# EasyEDA Pro project AddonDragon.epro

# Schematic Schematic1
Board Name: Board1; Create Date: 2025-07-26; Page Name: P1; Project Name: Luxcamp Badge 2025 Body; Schematic Name: Schematic1; Update Date: 2025-07-26; Company: EasyEDA.com; Page Size: A4; Version: V1.0
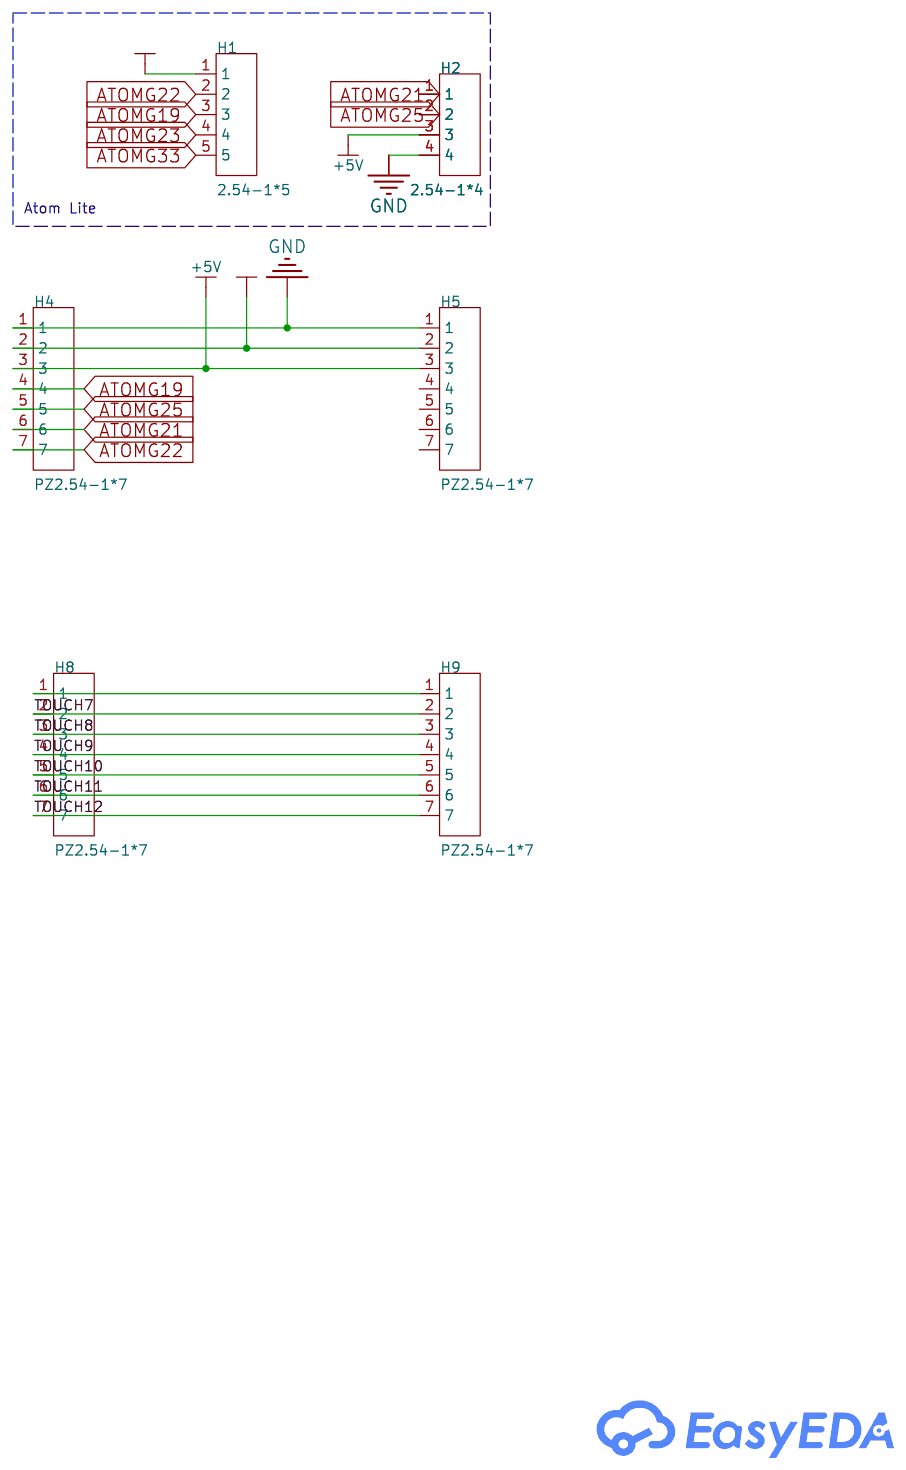
[diagram p0: schematic sheet]

## Parts
H1  2.54-1*5  [HDR-TH_5P-P2.54-V-M]
H2  2.54-1*4  [HDR-TH_4P-P2.54-V-M-1]
H4  PZ2.54-1*7  [HDR-TH_7P-P2.54-V-M]
H5  PZ2.54-1*7  [HDR-TH_7P-P2.54-V-M]
H8  PZ2.54-1*7  [HDR-TH_7P-P2.54-V-M]
H9  PZ2.54-1*7  [HDR-TH_7P-P2.54-V-M]

## Library data of the parts
H1 = 2.54-1*5: Pin Structure:1x5P Pitch:2.54mm Number of Rows:Single Row Number of Pins:5P; Supplier Part: C5156614; Manufacturer: ZHOURI(洲日); Supplier Footprint: 插件,P=2.54mm; JLCPCB Part Class: Extended Part; Datasheet: https://atta.szlcsc.com/upload/public/pdf/source/20250227/F941FC765EF241ABFB2D5D72948A31A5.pdf; Supplier: LCSC; Pin Structure: 1x5P; Pitch: 2.54mm; Number of Rows: Single Row; Number of Pins: 5P
H2 = 2.54-1*4: Pin Structure:1x4P Pitch:2.54mm Number of Rows:Single Row Number of Pins:4P; Supplier Part: C5116483; Manufacturer: ZHOURI(洲日); Supplier Footprint: 插件,P=2.54mm; JLCPCB Part Class: Extended Part; Datasheet: https://atta.szlcsc.com/upload/public/pdf/source/20250227/F941FC765EF241ABFB2D5D72948A31A5.pdf; Supplier: LCSC; Pin Structure: 1x4P; Pitch: 2.54mm; Number of Rows: Single Row; Number of Pins: 4P
H4 H5 H8 H9 = PZ2.54-1*7: Supplier Part: C5360900; Manufacturer: ZHOURI(洲日); Supplier Footprint: 插件,P=2.54mm; JLCPCB Part Class: Extended Part; Datasheet: https://atta.szlcsc.com/upload/public/pdf/source/20250227/F941FC765EF241ABFB2D5D72948A31A5.pdf; Supplier: LCSC

## Nets
3V3: H1.1 H4.2 H5.2
+5V: H2.3 H4.3 H5.3
GND: H2.4 H4.1 H5.1
ATOMG19: H1.3 H4.4
ATOMG21: H2.1 H4.6
ATOMG22: H1.2 H4.7
ATOMG23: H1.4
ATOMG25: H2.2 H4.5
ATOMG33: H1.5
TOUCH7: H8.2 H9.2
TOUCH8: H8.3 H9.3
TOUCH9: H8.4 H9.4
TOUCH10: H8.5 H9.5
TOUCH11: H8.6 H9.6
TOUCH12: H8.7 H9.7
LED_LEFT_OUT: H8.1 H9.1

Not connected (* = marked no-connect by the designer): H5 4 5 6 7

## Notes on the sheet
- Atom Lite

# Board PCB1
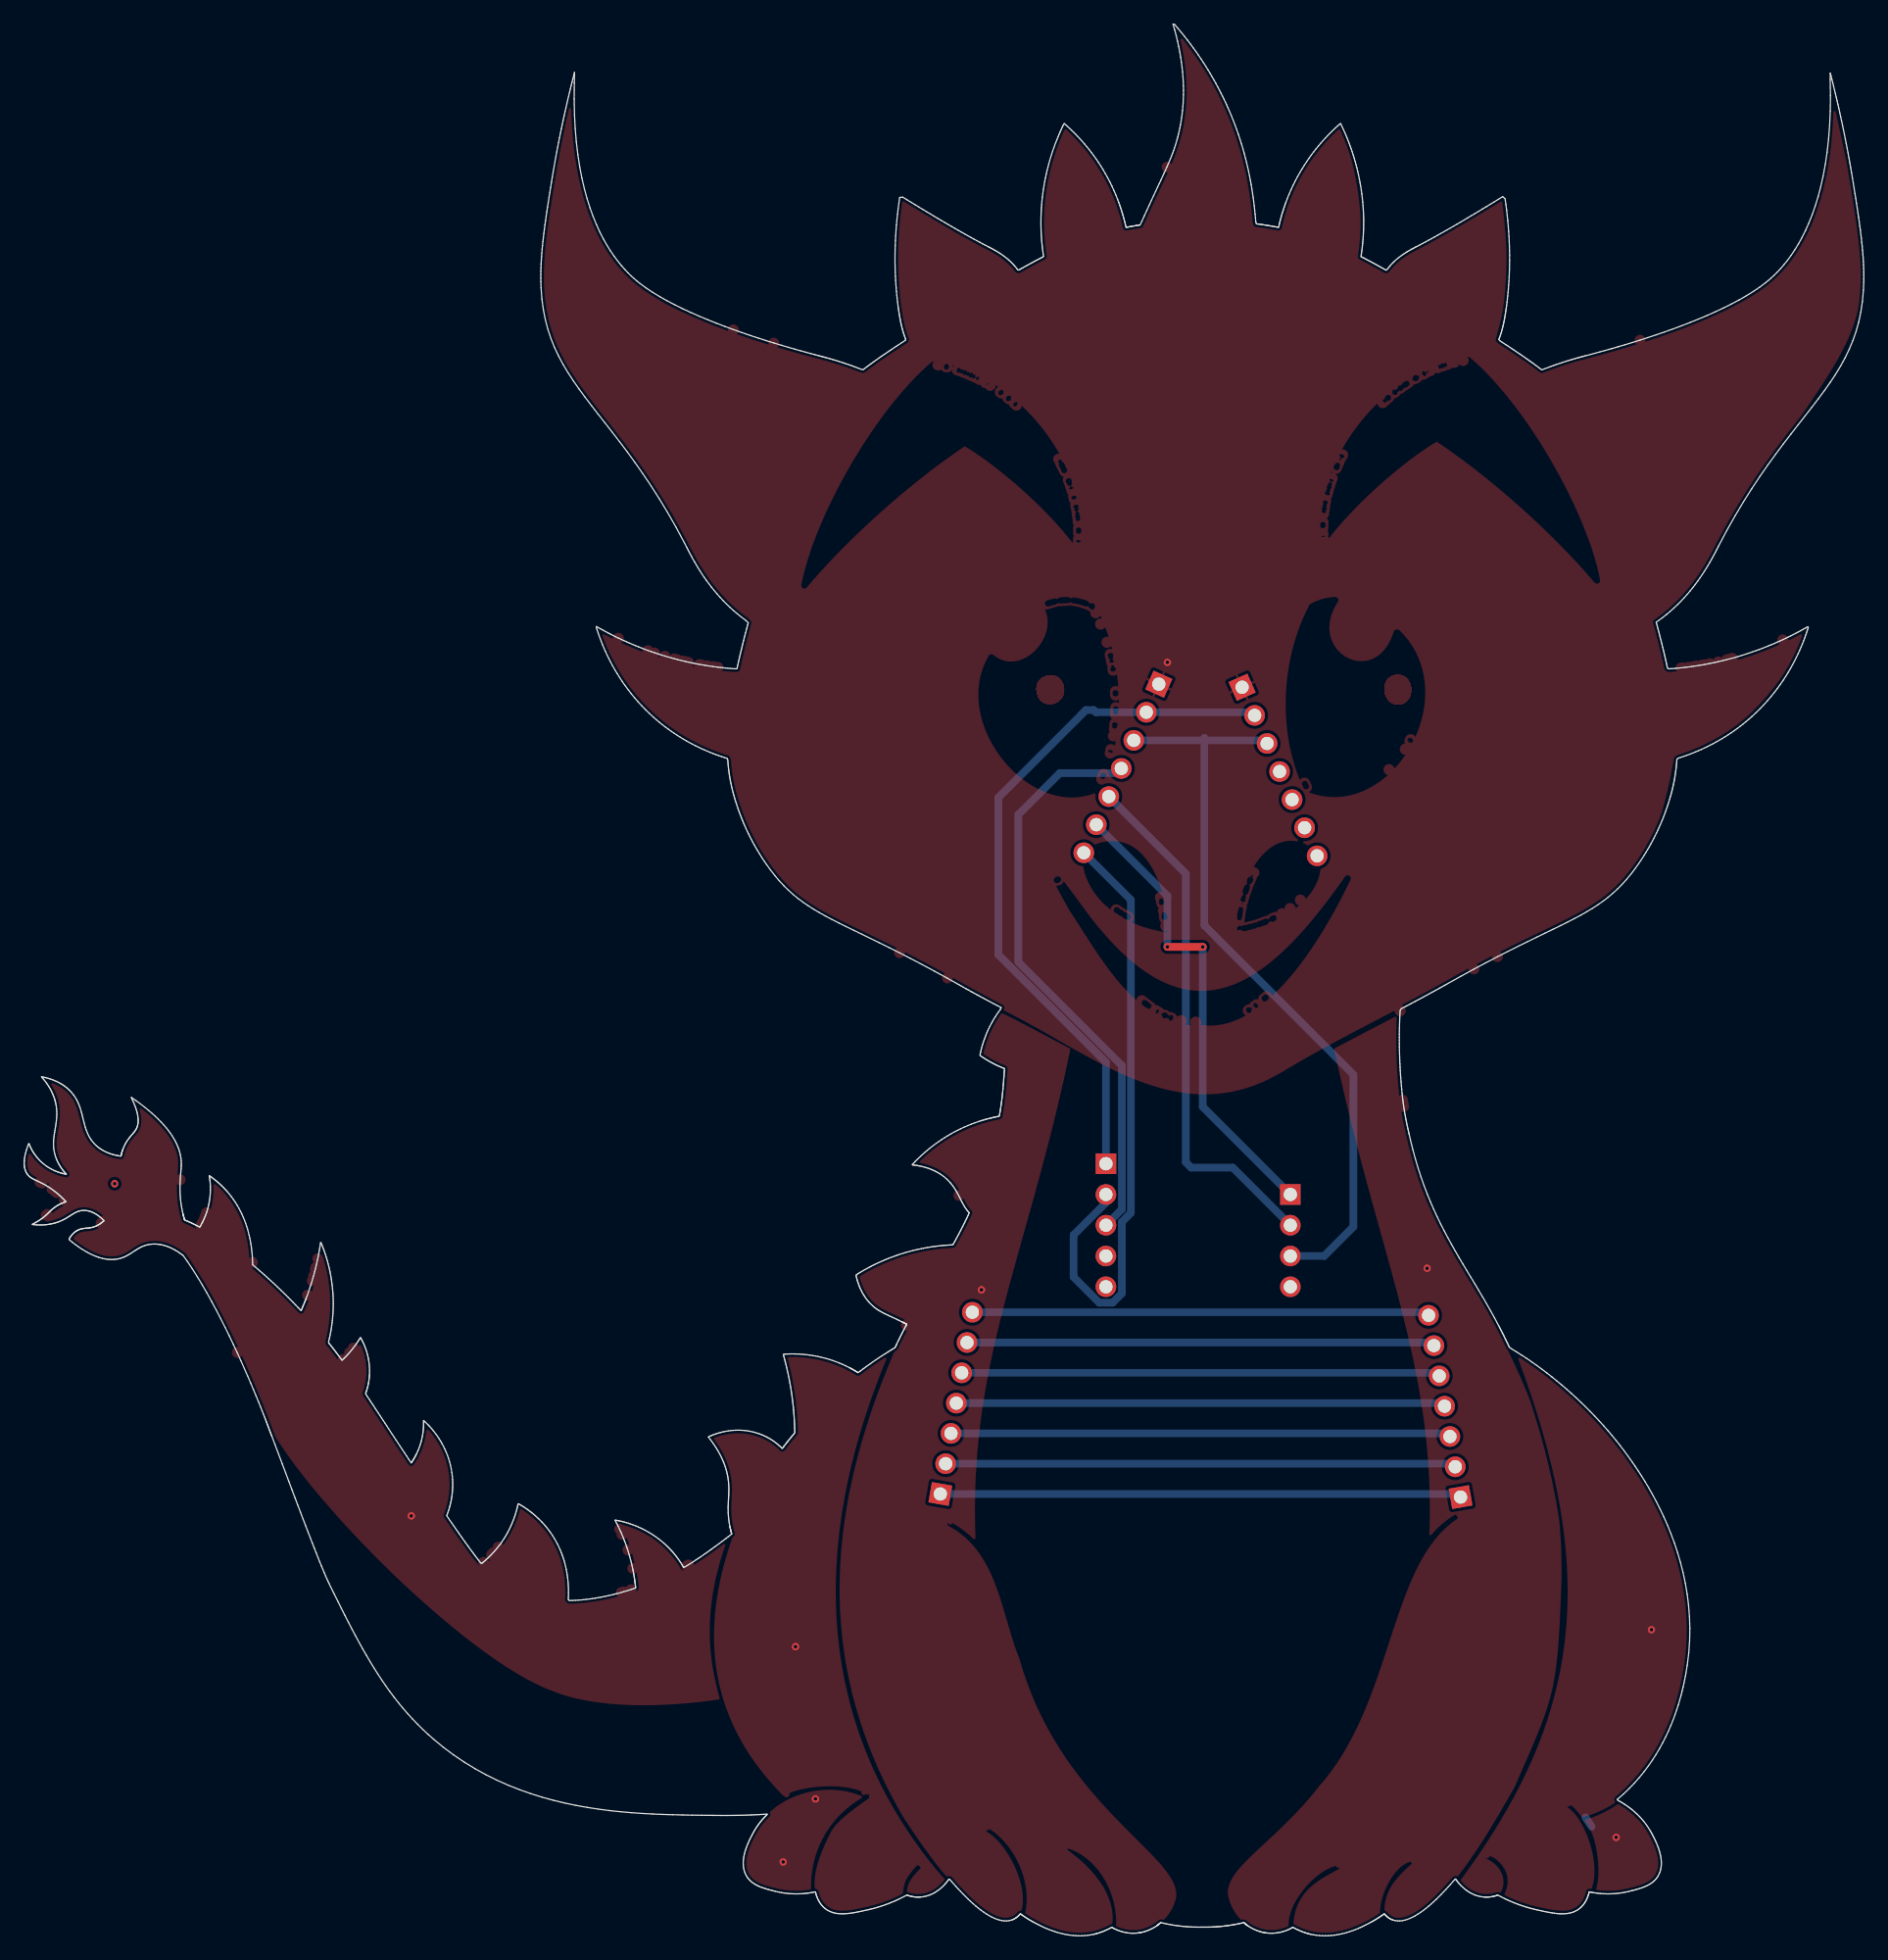
[diagram p1: board, top side]
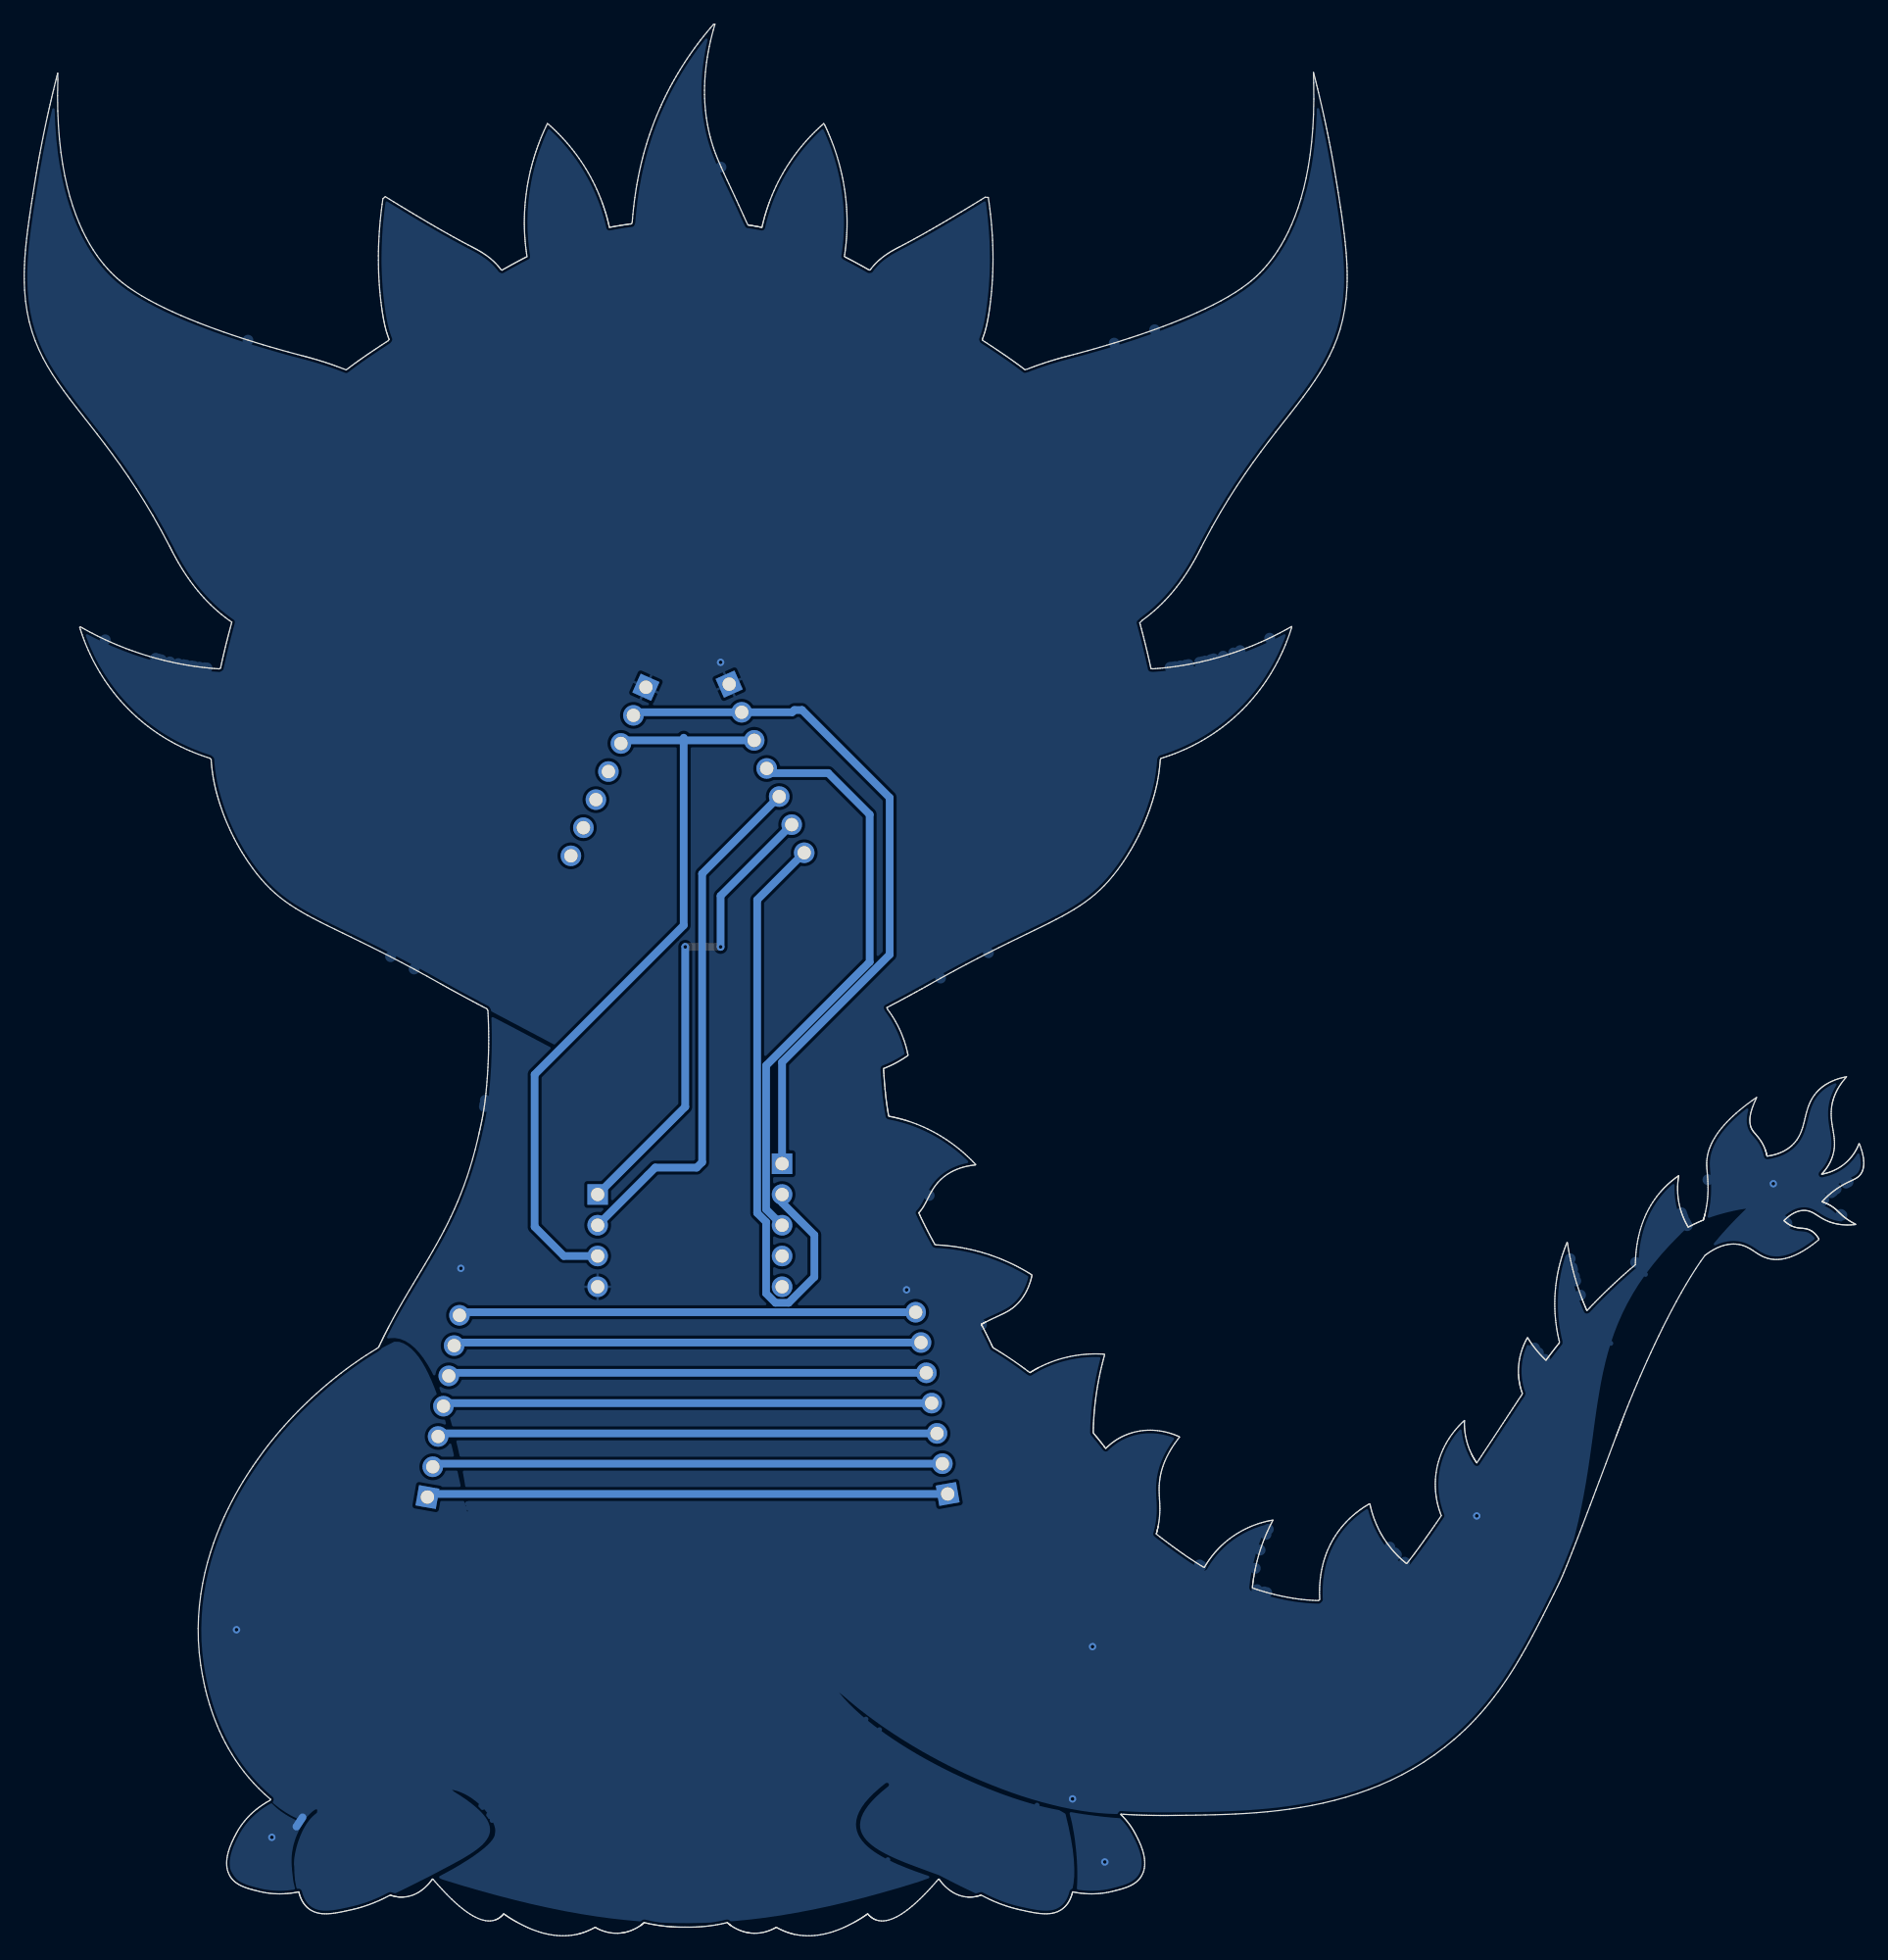
[diagram p2: board, bottom side, seen from below]

Outline 152.02 x 157.85 mm; copper layers: Top Layer, Bottom Layer. Coordinates in mm from the lower left corner of the outline.
Stack: Top Layer 0.035mm / Dielectric1 1.51mm FR4 er 4.5 / Bottom Layer 0.035mm

## Design rules (mm)
template: JLCPCB Capability(Two Layers Board)
spacing copperThickness1oz (default): track to track 0.102, other pairs 0.152 to 0.3
spacing copperThickness2oz: track to track 0.203, other pairs 0.152 to 0.3
track width copperThickness1oz (default): min 0.127, default 0.254, max 2.54
track width copperThickness2oz: min 0.203, default 0.254, max 2.54
differential pair differentialPair (default): width min 0.127, default 0.254, max 2.54; gap min 0.152, default 0.152
via viaSize (default): diameter min 0.5, default 0.61, max 10; hole min 0.3, default 0.305, max 6.3

## Placement (name value [footprint] x y rotation side)
H1  2.54-1*5  [HDR-TH_5P-P2.54-V-M]  89.39 58.67 270 top
H2  2.54-1*4  [HDR-TH_4P-P2.54-V-M-1]  104.63 57.4 270 top
H4  PZ2.54-1*7  [HDR-TH_7P-P2.54-V-M]  90.66 96.39 246 top
H5  PZ2.54-1*7  [HDR-TH_7P-P2.54-V-M]  103.74 96.14 294 top
H8  PZ2.54-1*7  [HDR-TH_7P-P2.54-V-M]  77.03 43.99 80 top
H9  PZ2.54-1*7  [HDR-TH_7P-P2.54-V-M]  117.37 43.73 100 top

## Footprints (pads in the part's own frame, mm; a bottom-side part is the same pattern mirrored in y, then rotated)
HDR-TH_4P-P2.54-V-M-1
  rect 1.7x1.7 hole 1.1: 1(-3.81,0)
  round 1.7 hole 1.1: 2(-1.27,0) 3(1.27,0) 4(3.81,0)
HDR-TH_5P-P2.54-V-M
  rect 1.7x1.7 hole 1.1: 1(-5.08,0)
  round 1.7 hole 1.1: 2(-2.54,0) 3(0,0) 4(2.54,0) 5(5.08,0)
HDR-TH_7P-P2.54-V-M
  rect 1.7x1.7 hole 1.1: 1(-7.62,0)
  round 1.7 hole 1.1: 2(-5.08,0) 3(-2.54,0) 4(0,0) 5(2.54,0) 6(5.08,0) 7(7.62,0)

## Nets
As in the schematic.

## Via types
v1: diameter 0.61, hole 0.305, Top Layer to Bottom Layer, 12 vias

## Routing (per net, layer and track width the routed paths; a pad name or vN(x,y) marks a point on that pad's centre or on a via; arc(x,y) is an arc through that point)
3V3: length 58.3
  Bottom Layer w0.635: H1.1 89.39,72.14 80.5,81.03 80.5,93.98 87.74,101.22 88.37,101.22 88.56,101.03 H4.2 101.42,101.03 H5.2
+5V: length 62.8
  Bottom Layer w0.635: 97.52,98.71 97.52,83.44 109.84,71.12 109.84,58.55 107.42,56.13 H2.3 ; 97.52,98.71 H4.3 ; 97.52,98.71 102.45,98.71 H5.3 ; 97.52,98.71 97.52,98.93
GND: length 0.9
  Bottom Layer w0.635: 129.01,9.78 129.52,9.02
  vias: v1(31.99,34.67) v1(62.72,6.1) v1(63.74,23.88) v1(65.39,11.3) v1(79.1,53.34) v1(94.47,105.16) v1(115.93,55.12) v1(131.55,8.13) v1(134.47,25.27)
(no net):
  vias: v1(7.47,62.1)
ATOMG19: length 48.1
  Bottom Layer w0.635: H1.3 90.71,59.99 90.71,71.86 82.15,80.42 82.15,92.58 85.58,96.01 90.28,96.01 H4.4
ATOMG21: length 38.9
  Top Layer w0.635: v1(94.47,81.66) v1(97.39,81.66)
  Bottom Layer w0.635: v1(94.47,81.66) 94.47,85.88 H4.6 ; H2.1 97.39,68.45 v1(97.39,81.66)
ATOMG22: length 51.4
  Bottom Layer w0.635: H4.7 91.45,85.55 91.45,59.69 90.71,58.95 90.71,53.05 89.94,52.27 88.84,52.27 86.72,54.39 86.72,57.87 89.39,60.54 H1.2
ATOMG25: length 43.6
  Bottom Layer w0.635: H4.5 95.99,87.71 95.99,63.88 96.44,63.43 99.87,63.43 H2.2
LED_LEFT_OUT: length 43.1
  Bottom Layer w0.635: 75.7,36.48 118.44,36.48 H9.1
TOUCH7: length 42.2
  Bottom Layer w0.635: 118.25,38.73 118,38.98 H8.2
TOUCH8: length 41.3
  Bottom Layer w0.635: H8.3 117.56,41.49 H9.3
TOUCH9: length 40.5
  Bottom Layer w0.635: H8.4 117.12,43.99 H9.4
TOUCH10: length 39.6
  Bottom Layer w0.635: H8.5 116.68,46.49 H9.5
TOUCH11: length 38.7
  Bottom Layer w0.635: H8.6 116.24,48.99 H9.6
TOUCH12: length 37.8
  Bottom Layer w0.635: H9.7 115.8,51.49 78.35,51.49

## Copper pours and planes (outline as drawn; the poured copper is in the pictures)
GND on Top Layer: outline of 847 points within -0.03,19.04 58.23,70.9
GND on Top Layer: outline of 157 points within 59.45,3.46 69.36,12.06
GND on Top Layer: outline of 397 points within 56.53,1.85 76.26,48.3
GND on Top Layer: outline of 902 points within 67.38,0 95.21,76.32
GND on Top Layer: outline of 305 points within 118.48,1.67 137.74,47.99
GND on Top Layer: outline of 744 points within 42.33,69.48 151.87,157.77
GND on Top Layer: outline of 440 points within 103.99,0.53 127.05,76.09
GND on Top Layer: outline of 102 points within 128.9,3.45 135.28,11.04
GND on Bottom Layer: outline of 1999 points within 14.52,1.04 152.12,157.93
GND on Bottom Layer: 131.76,11.2 129.01,9.31 129.02,9.26 129.12,9.08 129.21,8.91 129.34,8.65 129.38,8.57 129.51,8.25 129.6,8.01 129.65,7.86 129.76,7.49 129.56,3.69 129.71,3.67 130.01,3.64 130.3,3.61 130.59,3.6 130.86,3.59 131.12,3.59 131.38,3.59 131.62,3.6 131.86,3.62 132.09,3.65 132.31,3.68 132.52,3.72 132.72,3.76 132.92,3.81 133.1,3.87 133.28,3.93 133.45,4 133.61,4.07 133.76,4.15 133.9,4.23 134.04,4.32 134.17,4.41 134.29,4.51 134.4,4.61 134.5,4.72 134.6,4.83 134.68,4.94 134.76,5.06 134.83,5.18 134.9,5.31 134.95,5.43 135,5.56 135.04,5.7 135.07,5.84 135.1,5.98 135.12,6.12 135.12,6.26 135.13,6.41 135.12,6.56 135.11,6.71 135.09,6.86 135.06,7.02 135.03,7.17 134.99,7.33 134.94,7.49 134.88,7.64 134.82,7.8 134.75,7.96 134.68,8.13 134.59,8.29 134.5,8.45 134.41,8.61 134.3,8.77 134.19,8.93 134.08,9.09 133.95,9.25 133.82,9.41 133.69,9.57 133.54,9.73 133.39,9.88 133.24,10.04 133.07,10.19 132.91,10.34 132.73,10.49 132.55,10.64 132.36,10.78 132.17,10.93 131.97,11.07
GND on Bottom Layer: outline of 88 points within 59.41,3.46 65.67,10.24
(no net) on Top Layer: 112.41,104.12 114.61,104.12 114.61,101.67 112.41,101.67
(no net) on Top Layer: 112.41,104.12 114.61,104.12 114.61,101.67 112.41,101.67
(no net) on Top Layer: 112.41,104.12 114.61,104.12 114.61,101.67 112.41,101.67
(no net) on Top Layer: outline of 287 points within 104.5,94.29 115.52,110.3
(no net) on Top Layer: 83.65,104.09 85.93,104.09 85.93,101.71 83.65,101.71
(no net) on Top Layer: 83.65,104.09 85.93,104.09 85.93,101.71 83.65,101.71
(no net) on Top Layer: 112.41,104.12 114.61,104.12 114.61,101.67 112.41,101.67
(no net) on Top Layer: 112.41,104.12 114.61,104.12 114.61,101.67 112.41,101.67
(no net) on Top Layer: 112.41,104.12 114.61,104.12 114.61,101.67 112.41,101.67
(no net) on Top Layer: 112.41,104.12 114.61,104.12 114.61,101.67 112.41,101.67
(no net) on Top Layer: 112.41,104.12 114.61,104.12 114.61,101.67 112.41,101.67
(no net) on Top Layer: 83.65,104.09 85.93,104.09 85.93,101.71 83.65,101.71
(no net) on Top Layer: 83.65,104.09 85.93,104.09 85.93,101.71 83.65,101.71
(no net) on Top Layer: 83.65,104.09 85.93,104.09 85.93,101.71 83.65,101.71
(no net) on Top Layer: 83.65,104.09 85.93,104.09 85.93,101.71 83.65,101.71
(no net) on Top Layer: 112.41,104.12 114.61,104.12 114.61,101.67 112.41,101.67
(no net) on Top Layer: 112.41,104.12 114.61,104.12 114.61,101.67 112.41,101.67
(no net) on Top Layer: 83.65,104.09 85.93,104.09 85.93,101.71 83.65,101.71
(no net) on Top Layer: outline of 116 points within 100.35,83.12 106.89,90.16
(no net) on Top Layer: 83.65,104.09 85.93,104.09 85.93,101.71 83.65,101.71
(no net) on Top Layer: 112.41,104.12 114.61,104.12 114.61,101.67 112.41,101.67
(no net) on Top Layer: 83.65,104.09 85.93,104.09 85.93,101.71 83.65,101.71
(no net) on Top Layer: 83.65,104.09 85.93,104.09 85.93,101.71 83.65,101.71
(no net) on Top Layer: 83.65,104.09 85.93,104.09 85.93,101.71 83.65,101.71
(no net) on Top Layer: 83.65,104.09 85.93,104.09 85.93,101.71 83.65,101.71
(no net) on Top Layer: outline of 315 points within 79.11,94.26 90.21,109.95
(no net) on Top Layer: 83.65,104.09 85.93,104.09 85.93,101.71 83.65,101.71
(no net) on Top Layer: 83.65,104.09 85.93,104.09 85.93,101.71 83.65,101.71
(no net) on Top Layer: 83.65,104.09 85.93,104.09 85.93,101.71 83.65,101.71
(no net) on Top Layer: 83.65,104.09 85.93,104.09 85.93,101.71 83.65,101.71
(no net) on Top Layer: 112.41,104.12 114.61,104.12 114.61,101.67 112.41,101.67
(no net) on Top Layer: 112.41,104.12 114.61,104.12 114.61,101.67 112.41,101.67
(no net) on Top Layer: 83.65,104.09 85.93,104.09 85.93,101.71 83.65,101.71
(no net) on Top Layer: 83.65,104.09 85.93,104.09 85.93,101.71 83.65,101.71
(no net) on Top Layer: 112.41,104.12 114.61,104.12 114.61,101.67 112.41,101.67
(no net) on Top Layer: 83.65,104.09 85.93,104.09 85.93,101.71 83.65,101.71
(no net) on Top Layer: 112.41,104.12 114.61,104.12 114.61,101.67 112.41,101.67
(no net) on Top Layer: 83.65,104.09 85.93,104.09 85.93,101.71 83.65,101.71
(no net) on Top Layer: 112.41,104.12 114.61,104.12 114.61,101.67 112.41,101.67
(no net) on Top Layer: 83.65,104.09 85.93,104.09 85.93,101.71 83.65,101.71
(no net) on Top Layer: 112.41,104.12 114.61,104.12 114.61,101.67 112.41,101.67
(no net) on Top Layer: 83.65,104.09 85.93,104.09 85.93,101.71 83.65,101.71
(no net) on Top Layer: 83.65,104.09 85.93,104.09 85.93,101.71 83.65,101.71
(no net) on Top Layer: outline of 154 points within 87.78,83.12 94.36,90.13
(no net) on Top Layer: 112.41,104.12 114.61,104.12 114.61,101.67 112.41,101.67
(no net) on Top Layer: 112.41,104.12 114.61,104.12 114.61,101.67 112.41,101.67
(no net) on Top Layer: 112.41,104.12 114.61,104.12 114.61,101.67 112.41,101.67
(no net) on Top Layer: outline of 128 points within 64.48,111.51 87.14,129.76
(no net) on Top Layer: 112.41,104.12 114.61,104.12 114.61,101.67 112.41,101.67
(no net) on Top Layer: 83.65,104.09 85.93,104.09 85.93,101.71 83.65,101.71
(no net) on Top Layer: 112.41,104.12 114.61,104.12 114.61,101.67 112.41,101.67
(no net) on Top Layer: outline of 224 points within 86.59,75.42 109.36,87.32
(no net) on Top Layer: 83.65,104.09 85.93,104.09 85.93,101.71 83.65,101.71
(no net) on Top Layer: 83.65,104.09 85.93,104.09 85.93,101.71 83.65,101.71
(no net) on Top Layer: 83.65,104.09 85.93,104.09 85.93,101.71 83.65,101.71
(no net) on Top Layer: 112.41,104.12 114.61,104.12 114.61,101.67 112.41,101.67
(no net) on Top Layer: 112.41,104.12 114.61,104.12 114.61,101.67 112.41,101.67
(no net) on Top Layer: 112.41,104.12 114.61,104.12 114.61,101.67 112.41,101.67
(no net) on Top Layer: 83.65,104.09 85.93,104.09 85.93,101.71 83.65,101.71
(no net) on Top Layer: 112.41,104.12 114.61,104.12 114.61,101.67 112.41,101.67
(no net) on Top Layer: 83.65,104.09 85.93,104.09 85.93,101.71 83.65,101.71
(no net) on Top Layer: 112.41,104.12 114.61,104.12 114.61,101.67 112.41,101.67
(no net) on Top Layer: 112.41,104.12 114.61,104.12 114.61,101.67 112.41,101.67
(no net) on Top Layer: 112.41,104.12 114.61,104.12 114.61,101.67 112.41,101.67
(no net) on Top Layer: 83.65,104.09 85.93,104.09 85.93,101.71 83.65,101.71
(no net) on Top Layer: 112.41,104.12 114.61,104.12 114.61,101.67 112.41,101.67
(no net) on Top Layer: 112.41,104.12 114.61,104.12 114.61,101.67 112.41,101.67
(no net) on Top Layer: 112.41,104.12 114.61,104.12 114.61,101.67 112.41,101.67
(no net) on Top Layer: 83.65,104.09 85.93,104.09 85.93,101.71 83.65,101.71
(no net) on Top Layer: 83.65,104.09 85.93,104.09 85.93,101.71 83.65,101.71
(no net) on Top Layer: 112.41,104.12 114.61,104.12 114.61,101.67 112.41,101.67
(no net) on Top Layer: 112.41,104.12 114.61,104.12 114.61,101.67 112.41,101.67
(no net) on Top Layer: 83.65,104.09 85.93,104.09 85.93,101.71 83.65,101.71
(no net) on Top Layer: 83.65,104.09 85.93,104.09 85.93,101.71 83.65,101.71
(no net) on Top Layer: 112.41,104.12 114.61,104.12 114.61,101.67 112.41,101.67
(no net) on Top Layer: 112.41,104.12 114.61,104.12 114.61,101.67 112.41,101.67
(no net) on Top Layer: 112.41,104.12 114.61,104.12 114.61,101.67 112.41,101.67
(no net) on Top Layer: 83.65,104.09 85.93,104.09 85.93,101.71 83.65,101.71
(no net) on Top Layer: 83.65,104.09 85.93,104.09 85.93,101.71 83.65,101.71
(no net) on Top Layer: 83.65,104.09 85.93,104.09 85.93,101.71 83.65,101.71
(no net) on Bottom Layer: outline of 421 points within -0.03,55.88 13.25,70.93

Small or netless copper shapes (teardrops, artwork), in the pictures only: 1 on Top Layer
